# Altium schematic sheet esp8266_shield.SchDoc
size A; SheetNumber: 1; SheetTotal: 1
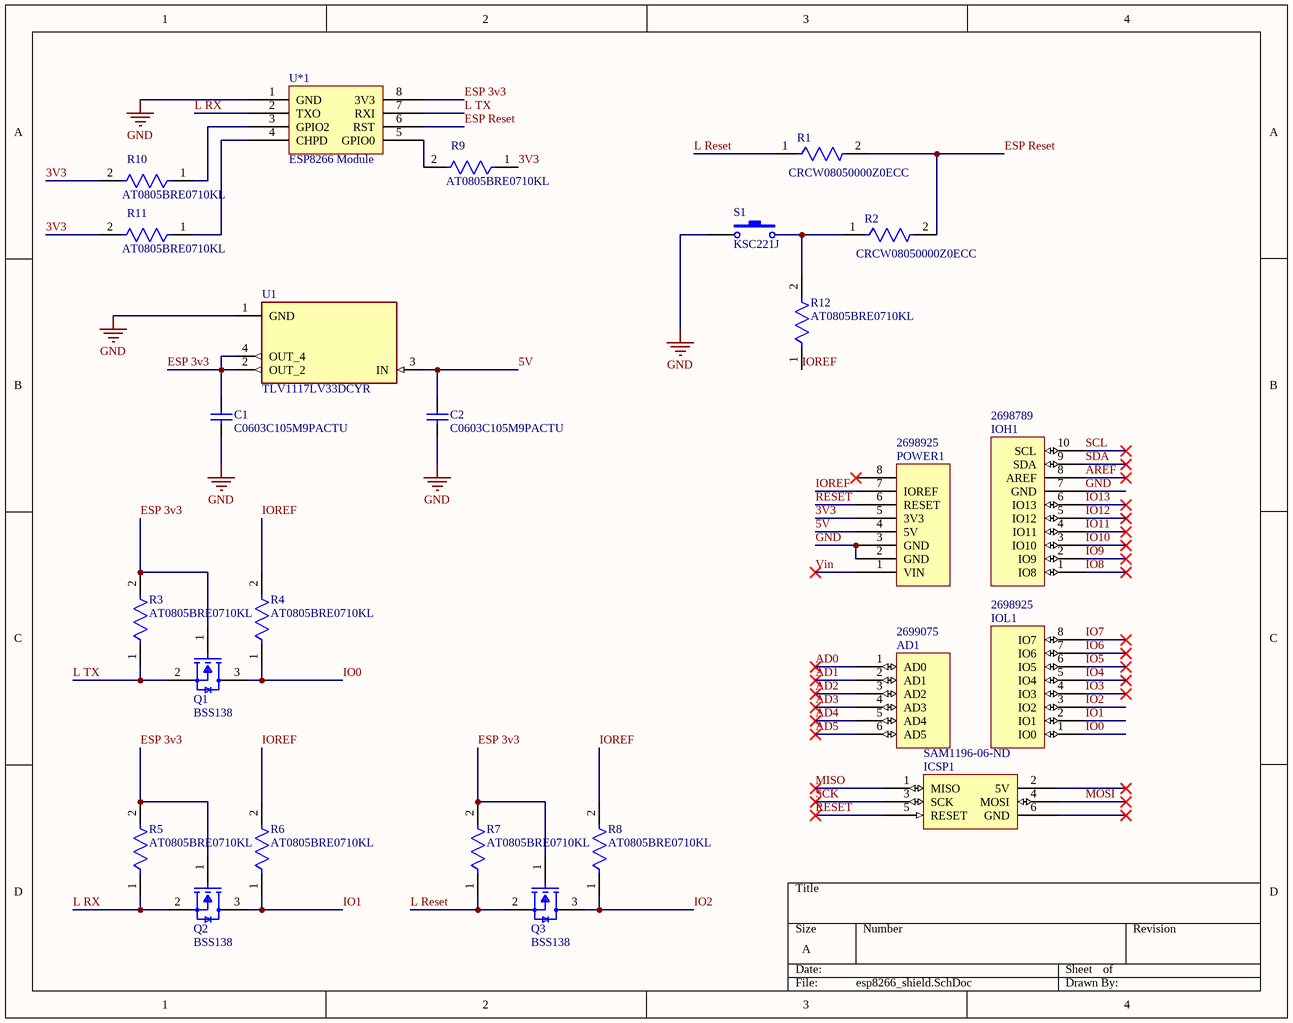
[diagram p0: esp8266_shield.SchDoc]

## Parts
AD1  Supplier Part Number 4: 2699075  [Header 6x1 8.5mm]  (hidden comment: AD)
C1  C0603C105M9PACTU  [CAPC1608X90X35ML15T15]
C2  C0603C105M9PACTU  [CAPC1608X90X35ML15T15]
ICSP1  Supplier Part Number 5: SAM1196-06-ND  [ICSP]  (hidden comment: ICSP)
IOH1  Supplier Part Number 3: 2698789  [Header 10x1 8.5mm]  (hidden comment: IOH)
IOL1  Supplier Part Number 4: 2698925  [Header 8x1 8.5mm]  (hidden comment: IOL)
POWER1  Supplier Part Number 4: 2698925  [Header 8x1 8.5mm]  (hidden comment: POWER_UNO)
Q1  BSS138  [FP-318-08-IPC_B]
Q2  BSS138  [FP-318-08-IPC_B]
Q3  BSS138  [FP-318-08-IPC_B]
R1  CRCW08050000Z0ECC  [FP-CRCW0805-Ce3-MFG]
R2  CRCW08050000Z0ECC  [FP-CRCW0805-Ce3-MFG]
R3  AT0805BRE0710KL  [FP-AT0805-IPC_C]
R4  AT0805BRE0710KL  [FP-AT0805-IPC_C]
R5  AT0805BRE0710KL  [FP-AT0805-IPC_C]
R6  AT0805BRE0710KL  [FP-AT0805-IPC_C]
R7  AT0805BRE0710KL  [FP-AT0805-IPC_C]
R8  AT0805BRE0710KL  [FP-AT0805-IPC_C]
R9  AT0805BRE0710KL  [FP-AT0805-IPC_C]
R10  AT0805BRE0710KL  [FP-AT0805-IPC_C]
R11  AT0805BRE0710KL  [FP-AT0805-IPC_C]
R12  AT0805BRE0710KL  [FP-AT0805-IPC_C]
S1  KSC221J  [ITT Cannon KSC2 Series]
U1  TLV1117LV33DCYR  [VREG_TLV1117LV33DCYR]
U*1  ESP8266 Module  [Copy of ESP8266 2x4 Connector]

## Nets
GND: C1.1 C2.1 IOH1.7(GND) POWER1.2(GND) POWER1.3(GND) S1.1 U1.1(GND) U*1.1(GND)
3V3: POWER1.5(3V3) R9.1 R10.2 R11.2
5V: C2.2 POWER1.4(5V) U1.3(IN)
AD0: AD1.1(AD0)
AD1: AD1.2(AD1)
AD2: AD1.3(AD2)
AD3: AD1.4(AD3)
AD4: AD1.5(AD4)
AD5: AD1.6(AD5)
AREF: IOH1.8(AREF)
ESP 3v3: C1.2 Q1.1(G) Q2.1(G) Q3.1(G) R3.2 R5.2 R7.2 U1.2(OUT_2) U1.4(OUT_4) U*1.8(3V3)
ESP Reset: R1.2 R2.2 U*1.6(RST)
IO0: IOL1.1(IO0) Q1.3(D) R4.1
IO1: IOL1.2(IO1) Q2.3(D) R6.1
IO2: IOL1.3(IO2) Q3.3(D) R8.1
IO3: IOL1.4(IO3)
IO4: IOL1.5(IO4)
IO5: IOL1.6(IO5)
IO6: IOL1.7(IO6)
IO7: IOL1.8(IO7)
IO8: IOH1.1(IO8)
IO9: IOH1.2(IO9)
IO10: IOH1.3(IO10)
IO11: IOH1.4(IO11)
IO12: IOH1.5(IO12)
IO13: IOH1.6(IO13)
IOREF: POWER1.7(IOREF) R4.2 R6.2 R8.2 R12.1
L Reset: Q3.2(S) R1.1 R7.1
L RX: Q2.2(S) R5.1 U*1.2(TXO)
L TX: Q1.2(S) R3.1 U*1.7(RXI)
MISO: ICSP1.1(MISO)
MOSI: ICSP1.4(MOSI)
RESET: ICSP1.5(RESET) POWER1.6(RESET)
SCK: ICSP1.3(SCK)
SCL: IOH1.10(SCL)
SDA: IOH1.9(SDA)
Vin: POWER1.1(VIN)
NetR2_1: R2.1 R12.2 S1.2
NetR9_2: R9.2 U*1.5(GPIO0)
NetR10_1: R10.1 U*1.3(GPIO2)
NetR11_1: R11.1 U*1.4(CHPD)

Not connected (* = marked no-connect by the designer): ICSP1 2(5V)* 6(GND)*; POWER1 8*

## Library data of the parts
C1 C2 = CMP-1035-02731-2: Manufacturer: Kemet; Part Number: C0603C105M9PACTU
Q1-Q3 = CMP-07173-000101-1: MOSFET N-CH 50V 220MA SOT-23; Turn-Off Delay Time: 20ns; Element Configuration: Single; Rds On Max: 3.5R; Gate to Source Voltage (Vgs): 20V; Threshold Voltage: 1.3V; Number of Elements: 1; Power Dissipation: 360mW; Rise Time: 9ns; Turn-On Delay Time: 2.5ns; Input Capacitance: 27pF; On-State Resistance: 6R; Lead Free: Lead Free; Length: 2.92mm; Width: 1.3mm; Drain to Source Breakdown Voltage: 50V; Min Operating Temperature: -55°C; REACH SVHC: No SVHC; Packaging: Tape and Reel; Radiation Hardening: No; Height: 0.93mm; Drain to Source Voltage (Vdss): 50V; Current Rating: 220mA; Voltage Rating (DC): 50V; Weight: 0.03g; Continuous Drain Current (ID): 220mA; Number of Pins: 3; Nominal Vgs: 1.3V; Max Power Dissipation: 360mW; Fall Time: 9ns; Drain to Source Resistance: 3.5R; Contact Plating: Tin; Case/Package: SOT-23; Package Quantity: 1; Dual Supply Voltage: 50V; Mount: Surface Mount; Termination: SMD/SMT; Max Operating Temperature: 150°C
R1 R2 = CMP-00030-87884303-1: CRCW08050000Z0ECC CRCW Thick Film Commodity Chip Resistor Jumper 0805 Size 0 Ohm 0.125 W 2-Pin SMD Paper T/R; Power Rating: 125mW; Resistance: 0Ω; Voltage Rating: 150V; Case/Package: 0805; NexarPartId: 87884303; Composition: Thick Film; Height: 600µm; Max Operating Temperature: 155°C; Min Operating Temperature: -55°C; RoHS: Compliant; Lead Free: Lead Free
R3-R12 = CMP-03412-048709-1: Thin Film Chip Resistors Automotive Grade 10kΩ 0.1% 50ppm/°C 0805
S1 = CMP-339-000013-1: SWITCH TACT SILVER J-LEAD; Manufacturer 1: ITT Cannon; Manufacturer Part Number 1: KSC221J; GFUPartNo: KSC221J; Part Type: SMT
U1 = CMP-550-000000-1: 1-A, low-dropout voltage regulator; MF: Texas Instruments; Source: TLV1117LV33DCYR.SchLib; Design Item ID: TLV1117LV33DCYR; Package: SOT-223-4 Texas Instruments; SnapEDA_Link: https://www.snapeda.com/parts/TLV1117LV33DCYR/Texas+Instruments/view-part/?ref=snap; MP: TLV1117LV33DCYR; Value: *; Digi-Key_Part_Number: 296-28778-2-ND; Component Type: Standard; Purchase-URL: https://pricing.snapeda.com/search/part/TLV1117LV33DCYR/?ref=eda; Check_prices: https://www.snapeda.com/parts/TLV1117LV33DCYR/Texas+Instruments/view-part/?ref=eda; Pin Count: 4
U*1 = CMP-006-0011-1: ESP8266 2x4 Module; Source: ESP8266Connector.SchLib; Design Item ID: ESP8266 2x4 Connector
AD1 = AD: Supplier 1: Arrow; Supplier Part Number 1: 2699089; Supplier 2: Digi-Key; Supplier Part Number 2: SAM1198-06-ND; Supplier 3: Arrow; Supplier Part Number 3: 2699088; Supplier 4: Arrow
ICSP1 = ICSP: Supplier 1: Arrow; Supplier Part Number 1: 2699117; Supplier 2: Arrow; Supplier Part Number 2: 2699116; Supplier 3: Digi-Key; Supplier Part Number 3: SAM1185-06-ND; Supplier 4: Arrow; Supplier Part Number 4: 2699091; Supplier 5: Digi-Key
IOH1 = IOH: Supplier 1: Arrow; Supplier Part Number 1: 2698803S4475693N1004; Supplier 2: Digi-Key; Supplier Part Number 2: SAM1198-10-ND; Supplier 3: Arrow
IOL1 = IOL: Supplier 1: Digi-Key; Supplier Part Number 1: SAM1198-08-ND; Supplier 2: Arrow; Supplier Part Number 2: 2698939; Supplier 3: Arrow; Supplier Part Number 3: 2698940; Supplier 4: Arrow
POWER1 = POWER_UNO: Supplier 1: Digi-Key; Supplier Part Number 1: SAM1198-08-ND; Supplier 2: Arrow; Supplier Part Number 2: 2698939; Supplier 3: Arrow; Supplier Part Number 3: 2698940; Supplier 4: Arrow